# EAGLE design PT4115_LED_Driver (EAGLE 6.0)
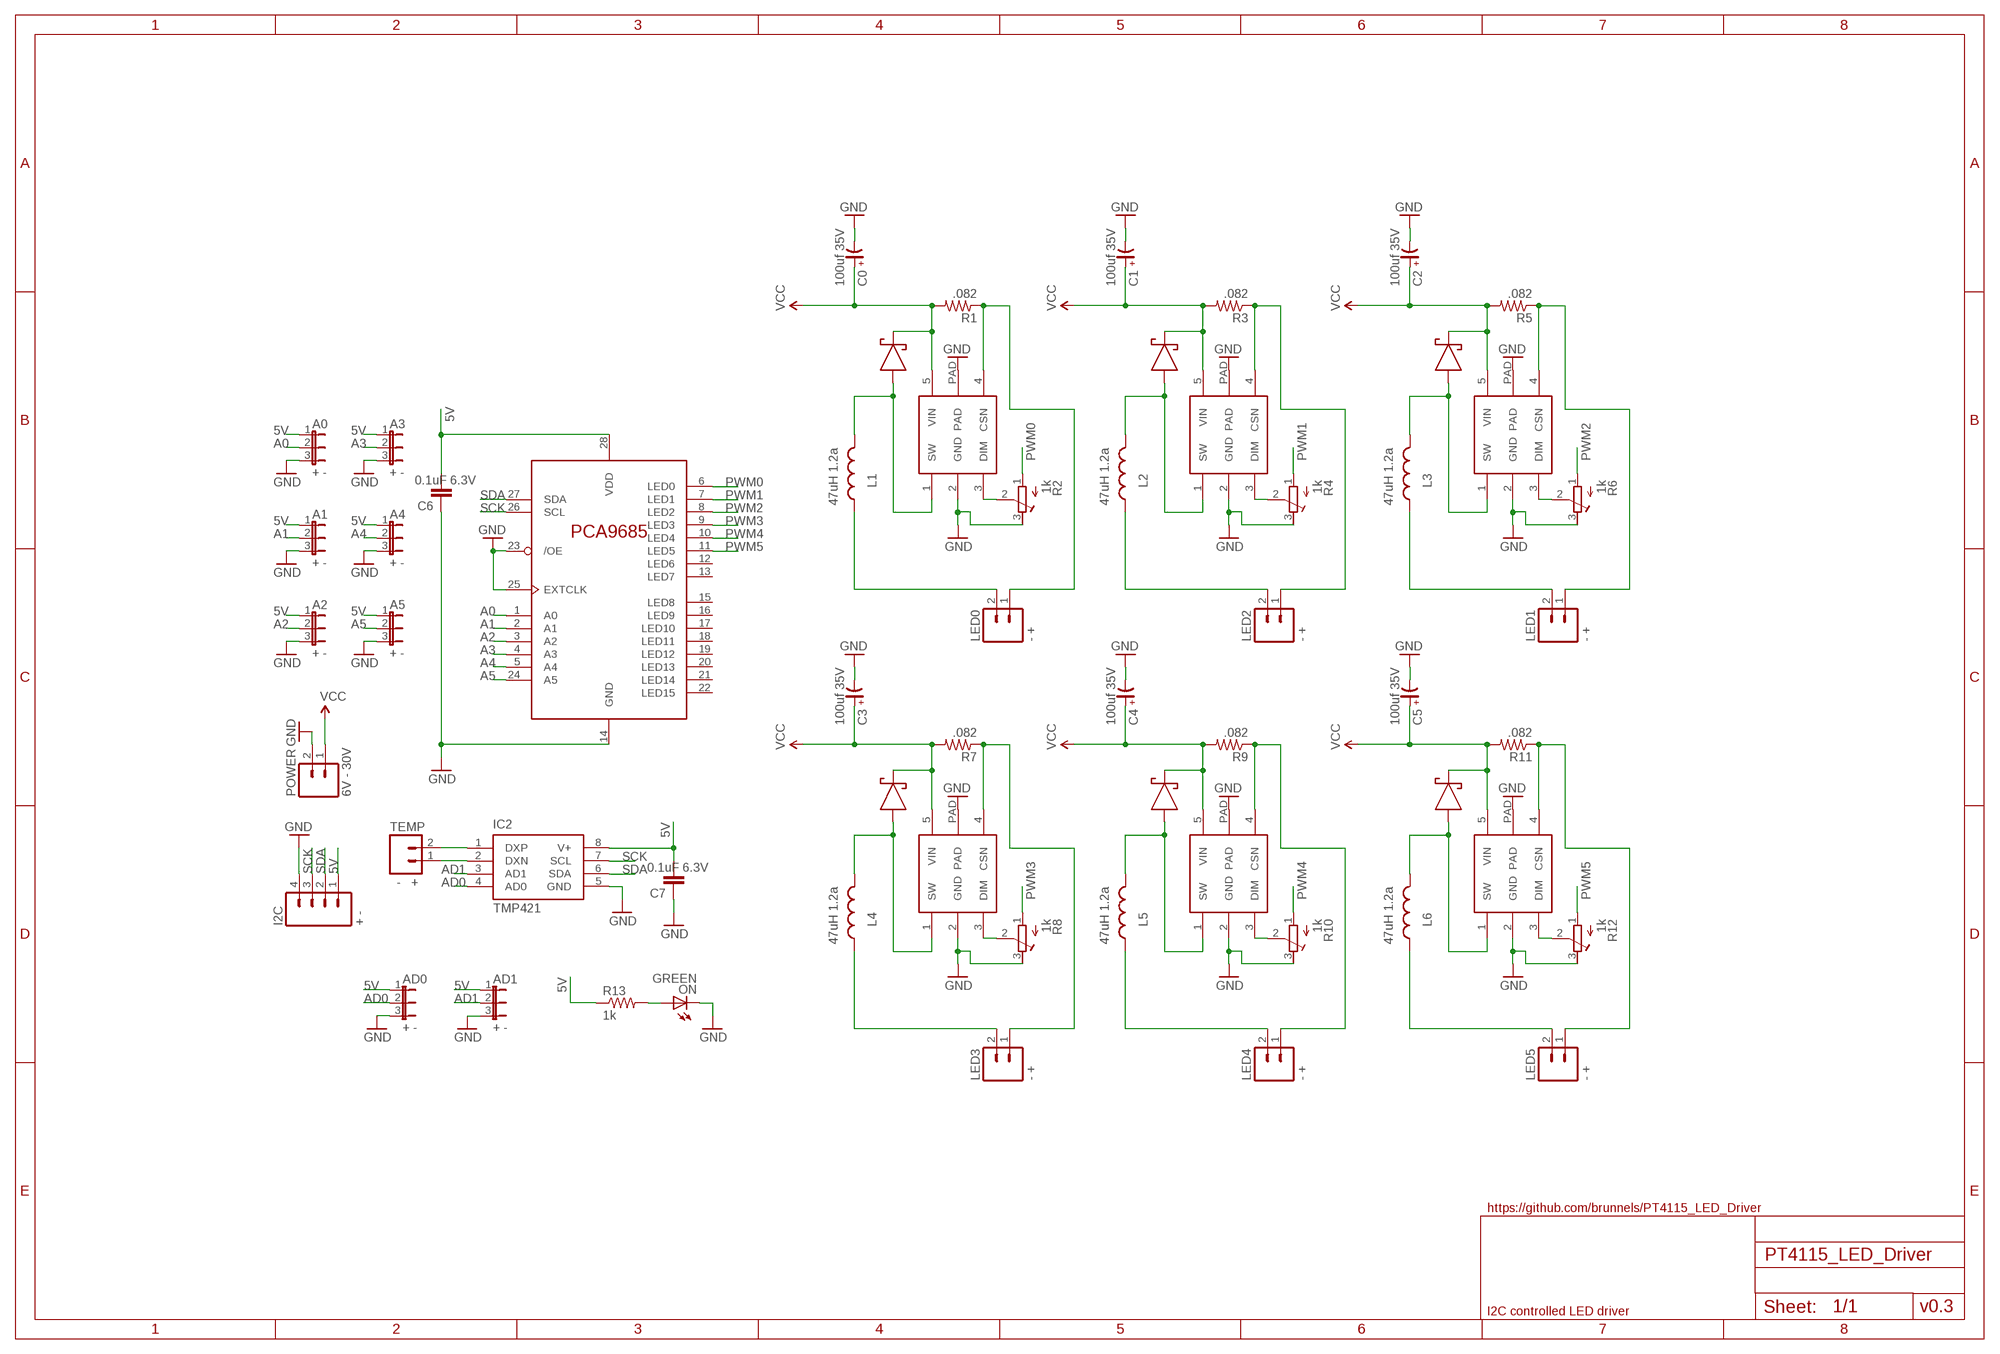
[diagram p0: schematic, sheet 1]

## Parts
A0  + -  JUMPER-3SMD  [SJ_3]
A1  + -  JUMPER-3SMD  [SJ_3]
A2  + -  JUMPER-3SMD  [SJ_3]
A3  + -  JUMPER-3SMD  [SJ_3]
A4  + -  JUMPER-3SMD  [SJ_3]
A5  + -  JUMPER-3SMD  [SJ_3]
AD0  + -  JUMPER-3SMD  [SJ_3]
AD1  + -  JUMPER-3SMD  [SJ_3]
C0  100uf 35V  CP_SV-E/F  [CSV-E/F]
C1  100uf 35V  CP_SV-E/F  [CSV-E/F]
C2  100uf 35V  CP_SV-E/F  [CSV-E/F]
C3  100uf 35V  CP_SV-E/F  [CSV-E/F]
C4  100uf 35V  CP_SV-E/F  [CSV-E/F]
C5  100uf 35V  CP_SV-E/F  [CSV-E/F]
C6  0.1uF 6.3V  CAP0805  [0805]
C7  0.1uF 6.3V  CAP0805  [0805]
D1  SCHOTTKY_DIODE-SS18  [DO-214]
D2  SCHOTTKY_DIODE-SS18  [DO-214]
D3  SCHOTTKY_DIODE-SS18  [DO-214]
D4  SCHOTTKY_DIODE-SS18  [DO-214]
D5  SCHOTTKY_DIODE-SS18  [DO-214]
D6  SCHOTTKY_DIODE-SS18  [DO-214]
DRV0  PT4115  [SOT89-5]
DRV1  PT4115  [SOT89-5]
DRV2  PT4115  [SOT89-5]
DRV3  PT4115  [SOT89-5]
DRV4  PT4115  [SOT89-5]
DRV5  PT4115  [SOT89-5]
I2C  + -  M04POLAR  [MOLEX-1X4]
IC1  PCA9685PW  [TSSOP28]
IC2  TMP421  [SOT23-8]
L1  47uH 1.2a  INDUCTORCR54  [CR54]
L2  47uH 1.2a  INDUCTORCR54  [CR54]
L3  47uH 1.2a  INDUCTORCR54  [CR54]
L4  47uH 1.2a  INDUCTORCR54  [CR54]
L5  47uH 1.2a  INDUCTORCR54  [CR54]
L6  47uH 1.2a  INDUCTORCR54  [CR54]
LED0  - +  M023.5MM  [SCREWTERMINAL-3.5MM-2]
LED1  - +  M023.5MM  [SCREWTERMINAL-3.5MM-2]
LED2  - +  M023.5MM  [SCREWTERMINAL-3.5MM-2]
LED3  - +  M023.5MM  [SCREWTERMINAL-3.5MM-2]
LED4  - +  M023.5MM  [SCREWTERMINAL-3.5MM-2]
LED5  - +  M023.5MM  [SCREWTERMINAL-3.5MM-2]
ON  GREEN  LEDCHIPLED_0805  [CHIPLED_0805]
POWER  6V - 30V  M023.5MM  [SCREWTERMINAL-3.5MM-2]
R1  .082  RESISTOR1206  [1206]
R2  1k  R-TRIMM3296W  [RTRIM3296W]
R3  .082  RESISTOR1206  [1206]
R4  1k  R-TRIMM3296W  [RTRIM3296W]
R5  .082  RESISTOR1206  [1206]
R6  1k  R-TRIMM3296W  [RTRIM3296W]
R7  .082  RESISTOR1206  [1206]
R8  1k  R-TRIMM3296W  [RTRIM3296W]
R9  .082  RESISTOR1206  [1206]
R10  1k  R-TRIMM3296W  [RTRIM3296W]
R11  .082  RESISTOR1206  [1206]
R12  1k  R-TRIMM3296W  [RTRIM3296W]
R13  1k  RESISTOR0603-RES  [0603-RES]
TEMP  - +  M02PTH  [1X02]

## Nets
5V: A0.1 A1.1 A2.1 A3.1 A4.1 A5.1 AD0.1 AD1.1 C6.2 C7.2 I2C.1 IC1.28(VDD) IC2.8(V+) R13.1
A0: A0.2 IC1.1(A0)
A1: A1.2 IC1.2(A1)
A2: A2.2 IC1.3(A2)
A3: A3.2 IC1.4(A3)
A4: A4.2 IC1.5(A4)
A5: A5.2 IC1.24(A5)
AD0: AD0.2 IC2.4(AD0)
AD1: AD1.2 IC2.3(AD1)
GND: A0.3 A1.3 A2.3 A3.3 A4.3 A5.3 AD0.3 AD1.3 C0.- C1.- C2.- C3.- C4.- C5.- C6.1 C7.1 DRV0.2(GND) DRV0.PAD DRV1.2(GND) DRV1.PAD DRV2.2(GND) DRV2.PAD DRV3.2(GND) DRV3.PAD DRV4.2(GND) DRV4.PAD DRV5.2(GND) DRV5.PAD I2C.4 IC1.14(GND) IC1.23(/OE) IC1.25(EXTCLK) IC2.5(GND) ON.C POWER.2 R2.3(A) R4.3(A) R6.3(A) R8.3(A) R10.3(A) R12.3(A)
N$1: DRV1.4(CSN) LED2.1 R3.1
N$2: IC2.1(DXP) TEMP.2
N$3: IC2.2(DXN) TEMP.1
N$4: D1.P$2(ANODE) DRV1.1(SW) L2.P$2
N$5: DRV1.3(DIM) R4.2(S)
N$6: DRV0.4(CSN) LED0.1 R1.1
N$7: D3.P$2(ANODE) DRV0.1(SW) L1.P$2
N$8: DRV0.3(DIM) R2.2(S)
N$10: L1.P$1 LED0.2
N$11: L2.P$1 LED2.2
N$12: DRV2.4(CSN) LED1.1 R5.1
N$13: D2.P$2(ANODE) DRV2.1(SW) L3.P$2
N$14: DRV2.3(DIM) R6.2(S)
N$15: L3.P$1 LED1.2
N$16: DRV3.4(CSN) LED3.1 R7.1
N$17: D4.P$2(ANODE) DRV3.1(SW) L4.P$2
N$18: DRV3.3(DIM) R8.2(S)
N$19: L4.P$1 LED3.2
N$20: DRV4.4(CSN) LED4.1 R9.1
N$21: D5.P$2(ANODE) DRV4.1(SW) L5.P$2
N$22: DRV4.3(DIM) R10.2(S)
N$23: L5.P$1 LED4.2
N$24: DRV5.4(CSN) LED5.1 R11.1
N$25: D6.P$2(ANODE) DRV5.1(SW) L6.P$2
N$26: DRV5.3(DIM) R12.2(S)
N$27: L6.P$1 LED5.2
N$30: ON.A R13.2
PWM0: IC1.6(LED0) R2.1(E)
PWM1: IC1.7(LED1) R4.1(E)
PWM2: IC1.8(LED2) R6.1(E)
PWM3: IC1.9(LED3) R8.1(E)
PWM4: IC1.10(LED4) R10.1(E)
PWM5: IC1.11(LED5) R12.1(E)
SCK: I2C.3 IC1.26(SCL) IC2.7(SCL)
SDA: I2C.2 IC1.27(SDA) IC2.6(SDA)
VCC: C0.+ C1.+ C2.+ C3.+ C4.+ C5.+ D1.P$1(CATHODE) D2.P$1(CATHODE) D3.P$1(CATHODE) D4.P$1(CATHODE) D5.P$1(CATHODE) D6.P$1(CATHODE) DRV0.5(VIN) DRV1.5(VIN) DRV2.5(VIN) DRV3.5(VIN) DRV4.5(VIN) DRV5.5(VIN) POWER.1 R1.2 R3.2 R5.2 R7.2 R9.2 R11.2
Unconnected: IC1.12(LED6) IC1.13(LED7) IC1.15(LED8) IC1.16(LED9) IC1.17(LED10) IC1.18(LED11) IC1.19(LED12) IC1.20(LED13) IC1.21(LED14) IC1.22(LED15)

## Notes on the sheet
- https://github.com/brunnels/PT4115_LED_Driver
- I2C controlled LED driver | v0.3

## Library data of the parts
A0 A1-A5 AD0 AD1 = SparkFun:JUMPER-3
C0 C1-C5 = rc-master:CP_: POLARIZED CAP
C6 C7 = SparkFun:CAP: Capacitor Standard 0603 ceramic capacitor, and 0.1" leaded capacitor.
D1-D6 = 1dah:SCHOTTKY_DIODE: 40V, 1A schottky diode
DRV0 DRV1-DRV5 = 1dah:PT4115: Small switching mode constant current PS
I2C = SparkFun:M04: Header 4 Standard 4-pin 0.1" header. Use with straight break away headers (SKU : PRT-00116), right angle break away headers (PRT-00553), swiss pins (PRT-00743), machine pins (PRT-00117), and female headers (PRT-00115). Molex polarized connector foot print use with SKU : PRT-08231 with associated crimp pins and housings. 1MM SMD Version SKU: PRT-10208
IC1 = i2c-led-controller:PCA9685
IC2 = mylib:TMP421
L1-L6 = SparkFun:INDUCTOR: Inductors Basic Inductor/Choke - 0603 and 1206. Footprints are not proven and vary greatly between part numbers.
LED0 LED1-LED5 POWER TEMP = SparkFun:M02: Header 2 Standard 2-pin 0.1" header. Use with straight break away headers (SKU : PRT-00116), right angle break away headers (PRT-00553), swiss pins (PRT-00743), machine pins (PRT-00117), and female headers (PRT-00115). Molex polarized connector foot print use with SKU : PRT-08233 with associated crimp pins and housings.
ON = led:LED: LED OSRAM: - CHIPLED LG R971, LG N971, LY N971, LG Q971, LY Q971, LO R971, LY R971 LH N974, LH R974 LS Q976, LO Q976, LY Q976 LO Q996 - Hyper CHIPLED LW Q18S LB Q993, LB Q99A, LB R99A - SideLED LS A670, LO A670, LY A670, LG A670, LP A670 LB A673, LV A673, LT A673, LW A673 LH A674 LY A675 LS A676, LA A676, LO A676, LY A676, LW A676 LS A679, LY A679, LG A679 - Hyper Micro SIDELED® LS Y876, LA Y876, LO Y876, LY Y876 LT Y87S - SmartLED LW L88C, LW L88S LB L89C, LB L89S, LG L890 LS L89K, LO L89K, LY L89K LS L896, LA L896, LO L896, LY L896 - TOPLED LS T670, LO T670, LY T670, LG T670, LP T670 LSG T670, LSP T670, LSY T670, LOP T670, LYG T670 LG T671, LOG T671, LSG T671 LB T673, LV T673, LT T673, LW T673 LH T674 LS T676, LA T676, LO T676, LY T676, LB T676, LH T676, LSB T676, LW T676 LB T67C, LV T67C, LT T67C, LS T67K, LO T67K, LY T67K, LW E67C LS E67B, LA E67B, LO E67B, LY E67B, LB E67C, LV E67C, LT E67C LW T67C LS T679, LY T679, LG T679 LS T770, LO T770, LY T770, LG T770, LP T770 LB T773, LV T773, LT T773, LW T773 LH T774 LS E675, LA E675, LY E675, LS T675 LS T776, LA T776, LO T776, LY T776, LB T776 LHGB T686 LT T68C, LB T68C - Hyper Mini TOPLED® LB M676 - Mini TOPLED Santana® LG M470 LS M47K, LO M47K, LY M47K Source: http://www.osram.convergy.de LUXEON: - LUMILED® LXK2-PW12-R00, LXK2-PW12-S00, LXK2-PW14-U00, LXK2-PW14-V00 LXK2-PM12-R00, LXK2-PM12-S00, LXK2-PM14-U00 LXK2-PE12-Q00, LXK2-PE12-R00, LXK2-PE12-S00, LXK2-PE14-T00, LXK2-PE14-U00 LXK2-PB12-K00, LXK2-PB12-L00, LXK2-PB12-M00, LXK2-PB14-N00, LXK2-PB14-P00, LXK2-PB14-Q00 LXK2-PR12-L00, LXK2-PR12-M00, LXK2-PR14-Q00, LXK2-PR14-R00 LXK2-PD12-Q00, LXK2-PD12-R00, LXK2-PD12-S00 LXK2-PH12-R00, LXK2-PH12-S00 LXK2-PL12-P00, LXK2-PL12-Q00, LXK2-PL12-R00 Source: www.luxeon.com KINGBRIGHT: KA-3528ASYC Source: www.kingbright.com
R1 R3 R5 R7 R9 R11 = 1dah:RESISTOR: Resistor
R2 R4 R6 R8 R10 R12 = resistor:R-TRIMM: Trimm resistor
R13 = SparkFun:RESISTOR: Resistor

## Board
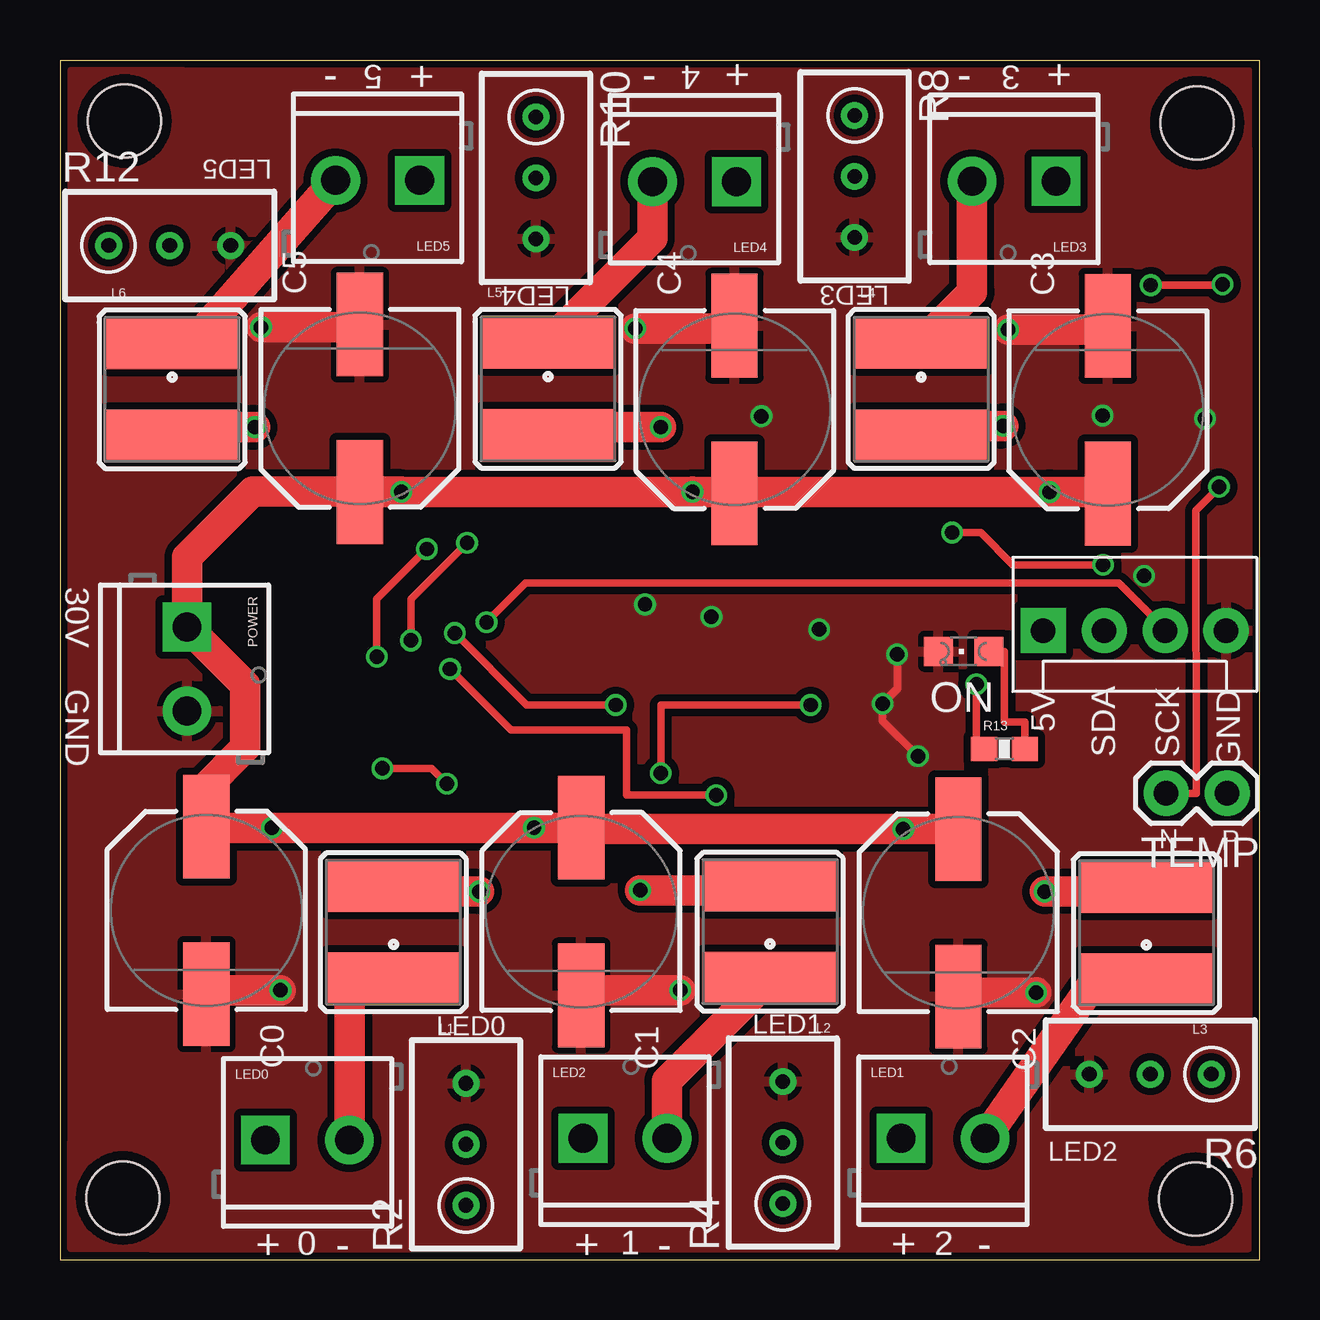
[diagram p1: board, top side]
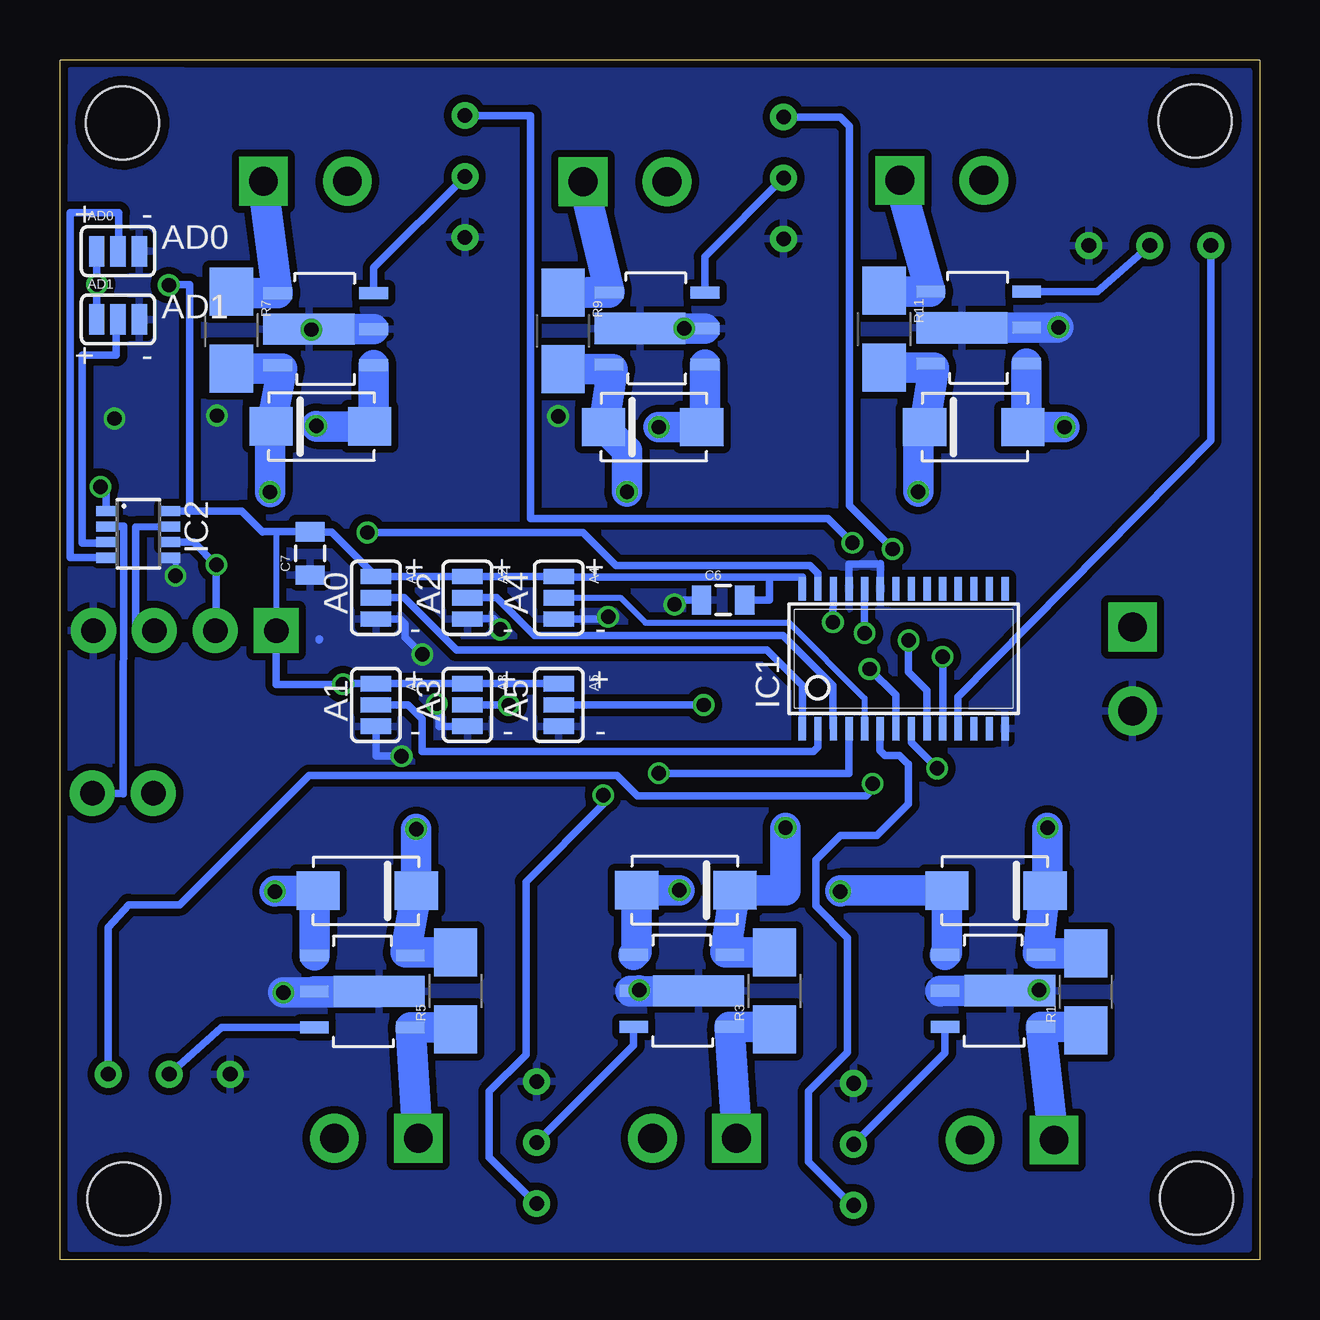
[diagram p2: board, bottom side, seen from below]

Size 50 x 50 mm. Coordinates in mm from the lower left corner, seen from the top.
Outline: 0,0 50,0 50,50 0,50 0,0
Copper layers (1*16): Top 0.035mm / dielectric 1.5mm / Bottom 0.035mm
Design rules: minimum track width 6mil, minimum drill 12mil, track to track 6mil, track to pad 6mil, pad to pad 6mil, via to via 6mil, smd to smd 0mil, copper to edge 10mil, drill to drill 10mil, minimum pad ring 10mil, minimum via ring 6mil, stop-mask expansion 2mil, vias tented up to drill 100mil, thermal gap 10mil

### Footprints (pad centres in the part's own frame; a part is rotated, then mirrored left to right if it is on the bottom)
STAND-OFF-TIGHT = hole 3.048: 0,0
SJ_3 = smd 0.635 x 1.27: 1 -0.889,0; 2 0,0; 3 0.889,0
CSV-E/F = smd 4.318 x 1.93: + -3.493,0; - 3.493,0
0805 = smd 0.8 x 1.2: 1 -0.9,0; 2 0.9,0
DO-214 = smd 1.8 x 1.6: P$1 -2.1,0; P$2 2,0
SOT89-5 = smd 0.5 x 1.2: 1 -1.5,-2; 2 0,-2; 3 1.5,-2; 4 1.5,2; 5 -1.5,2 | smd 1.3 x 3.8: PAD 0,0.7
MOLEX-1X4 = drill 1.016 pad 1.88 square: 1 0,0 | drill 1.016 pad 1.88: 2 2.54,0; 3 5.08,0; 4 7.62,0
TSSOP28 = smd 0.305 x 0.991: 1 -4.225,-2.918; 2 -3.575,-2.918; 3 -2.925,-2.918; 4 -2.275,-2.918; 5 -1.625,-2.918; 6 -0.975,-2.918; 7 -0.325,-2.918; 8 0.325,-2.918; 9 0.975,-2.918; 10 1.625,-2.918; 11 2.275,-2.918; 12 2.925,-2.918; 13 3.575,-2.918; 14 4.225,-2.918; 15 4.225,2.918; 16 3.575,2.918; 17 2.925,2.918; 18 2.275,2.918; 19 1.625,2.918; 20 0.975,2.918; 21 0.325,2.918; 22 -0.325,2.918; 23 -0.975,2.918; 24 -1.625,2.918; 25 -2.275,2.918; 26 -2.925,2.918; 27 -3.575,2.918; 28 -4.225,2.918
SOT23-8 = smd 0.42 x 0.8: 1 -0.95,-1.55; 2 -0.3,-1.55; 3 0.35,-1.55; 4 1,-1.55; 5 1,1.15; 6 0.35,1.15; 7 -0.3,1.15; 8 -0.95,1.15
CR54 = smd 5.5 x 2.15: P$1 0,1.92; P$2 0,-1.92
SCREWTERMINAL-3.5MM-2 = drill 1.2 pad 2.032 square: 1 0,0 | drill 1.2 pad 2.032: 2 3.5,0
CHIPLED_0805 = smd 1.2 x 1.2: A 0,-1.05; C 0,1.05
1206 = smd 2 x 1.8: 1 -1.6,0; 2 1.6,0
RTRIM3296W = drill 0.61: 1 0,-2.54; 2 0,0; 3 0,2.54
0603-RES = smd 1.1 x 1: 1 -0.85,0; 2 0.85,0
1X02 = drill 1.016 pad 1.88: 1 0,0; 2 2.54,0

### Placement (x,y rotation side)
5V  [STAND-OFF-TIGHT]  2.69,47.46 0 top
5V1  [STAND-OFF-TIGHT]  47.4,47.38 0 top
A0  36.83,27.58 270 bottom
A1  36.83,23.11 270 bottom
A2  33.02,27.58 270 bottom
A3  33.02,23.11 270 bottom
A4  29.21,27.58 270 bottom
A5  29.21,23.11 270 bottom
AD0  47.58,42.03 0 bottom
AD1  47.58,39.19 0 bottom
C0  6.1,14.55 270 top
C1  21.72,14.5 270 top
C2  37.45,14.45 270 top
C3  43.68,35.42 90 top
C4  28.12,35.43 90 top
C5  12.5,35.48 90 top
C6  22.36,27.49 0 bottom
C7  39.57,29.44 90 bottom
D1  23.96,15.39 180 bottom
D2  37.24,15.37 180 bottom
D3  11.04,15.38 180 bottom
D4  39.1,34.72 0 bottom
D5  25.25,34.7 0 bottom
D6  11.86,34.7 0 bottom
DRV0  11.11,11.2 270 bottom
DRV1  24.09,11.2 270 bottom
DRV2  37.4,11.18 270 bottom
DRV3  38.92,38.79 90 bottom
DRV4  25.12,38.81 90 bottom
DRV5  11.71,38.84 90 bottom
I2C  40.99,26.21 0 top
IC1  14.83,25.04 0 bottom
IC2  46.53,30.25 270 bottom
L1  13.9,13.64 180 top
L2  29.6,13.67 180 top
L3  45.29,13.61 180 top
L4  35.9,36.28 0 top
L5  20.35,36.3 0 top
L6  4.67,36.27 0 top
LED0  8.57,4.98 0 top
LED1  35.06,5.05 0 top
LED2  21.8,5.05 0 top
LED3  41.52,44.95 180 top
LED4  28.19,44.93 180 top
LED5  14.99,44.98 180 top
ON  37.67,25.35 90 top
POWER  5.3,26.37 270 top
R1  7.25,11.15 90 bottom
R2  16.92,4.8 0 top
R3  20.23,11.2 90 bottom
R4  30.13,4.88 0 top
R5  33.51,11.2 90 bottom
R6  45.45,7.72 90 top
R7  42.85,38.73 270 bottom
R8  33.12,45.15 180 top
R9  29.03,38.71 270 bottom
R10  19.84,45.09 180 top
R11  15.65,38.79 270 bottom
R12  4.57,42.27 270 top
R13  39.37,21.29 0 top
TEMP  48.65,19.44 180 top
U$3  [STAND-OFF-TIGHT]  47.33,2.52 0 top
U$4  [STAND-OFF-TIGHT]  2.62,2.57 0 top

### Tracks (layer width: path | path; a pad name or v marks a point on that pad's centre or on a via)
5V  (via drill 0.6)
  Top 0.254: 38.2,21.7 R13.1
  Top 0.305: v38.2,23.98 38.2,21.7 | v45.47,40.62 48.46,40.62 v48.46,40.64
  Bottom 0.254: A4.1 29.23,28.47 29.23,28.45 | 40.44,30.35 41,30.35 40.99,30.35 I2C.1
  Bottom 0.305: AD0.1 AD1.1 v48.46,40.64 | A4.1 A2.1 A0.1 38.68,30.33 39.57,30.33 | A5.1 A3.1 A1.1 38.1,24 v38.2,23.98 40.99,23.98 I2C.1 40.44,26.21 | C7.2 40.44,30.35 | IC1.28 19.06,28.45 20.42,28.45 | 29.26,28.45 29.23,28.45 20.42,28.45 | IC2.8 44.6,31.2 | 44.6,31.2 42.43,31.2 41.55,30.33 41.55,30.34 C7.2 | C7.2 39.57,30.33 | 39.57,30.33 39.6,30.33 | C6.2 20.42,27.49 20.42,28.45 | 44.6,31.2 44.6,40.64 45.47,40.64 v45.47,40.62
A0
  Bottom 0.305: A0.2 35.66,27.58 33.48,25.4 20.52,25.4 19.05,23.93 IC1.1
  Bottom 0.406: 36.85,27.6 A0.2
A1
  Bottom 0.305: IC1.2 18.41,21.37 18.59,21.18 34.9,21.18 34.9,22.53 35.48,23.11 A1.2
A2
  Bottom 0.305: A2.2 31.8,27.58 30.23,26.01 19.86,26.01 17.78,23.93 17.78,22.15 IC1.3
A3  (via drill 0.6)
  Top 0.305: v25.04,20.27 25.04,23.11 v31.29,23.11
  Bottom 0.305: IC1.4 17.12,20.27 v25.04,20.27 | v31.29,23.11 A3.2
A4
  Bottom 0.254: A4.2 26.64,27.58 25.6,26.54 19.61,26.54 16.46,23.39 IC1.5
  Bottom 0.305: IC1.5
A5  (via drill 0.6)
  Top 0.305: v23.16,23.11 19.46,23.11 v16.46,26.11
  Bottom 0.305: A5.2 v23.16,23.11 | v16.46,26.11 IC1.24 | IC1.24
AD0
  Bottom 0.305: AD0.2 47.55,42.03 47.55,43.64 49.58,43.64 49.58,29.26 48.69,29.26 IC2.4
AD1
  Bottom 0.305: AD1.2 47.65,39.19 47.65,37.69 49.07,37.69 49.07,29.87 47.88,29.87 IC2.3
GND  (via drill 0.6)
  Top 0.254: v45.19,28.5 45.21,28.52 45.41,28.52
  Top 0.305: v34.29,23.16 34.9,23.77 | 34.9,23.77 v34.9,25.22 | 34.9,23.77 34.87,23.77 34.29,23.19 34.29,22.45 v35.76,20.98
  Top 1.27: v8.38,38.86 12.5,38.86 C5.- | v23.98,38.81 27.96,38.81 C4.- | C3.- 43.69,38.76 v39.52,38.76 | v40.69,11.12 37.58,11.11 C2.- | C1.- 21.94,11.23 v25.86,11.23 | v9.2,11.23 5.93,11.21 C0.-
  Bottom 0.152: 36.1,11.15 DRV2.PAD
  Bottom 0.254: IC2.5 45.19,29.05 v45.19,28.5
  Bottom 0.305: IC1.25 17.11,28.97 17.12,28.98 15.82,28.98 15.8,29.01 15.8,27.97 IC1.23 | A4.3 27.25,26.7 v27.15,26.8 | v31.65,26.26 31.67,26.29 31.67,26.47 31.93,26.72 32.99,26.72 A2.3 | A0.3 35.81,26.7 35.61,26.49 35.61,25.93 v34.9,25.22 | A3.3 34.19,22.23 34.19,23.06 v34.29,23.16 | v35.76,20.98 36.83,20.98 A1.3 | 39.17,25.86 39.19,25.86 39.19,25.83 | C6.1 24.32,27.49 v24.38,27.3
  Bottom 1.27: DRV3.PAD DRV3.2 | DRV5.2 DRV5.PAD 8.43,38.84 v8.38,38.86 | DRV4.2 DRV4.PAD v23.98,38.81 | 13.31,11.18 13.31,11.2 DRV0.PAD 10.38,11.23 v9.2,11.23 | DRV2.2 DRV2.PAD 36.75,11.12 v40.69,11.12 | DRV1.2 26.21,11.2 26.21,11.18 25.81,11.18 | DRV1.PAD 23.39,11.18 25.81,11.18 | v25.86,11.23 25.81,11.18
  other vias: 43.46,35.18 29.24,35.15 47.73,35.05
  pour Bottom (isolate 0.305): 0.2,49.78 49.58,49.78 49.58,0.2 0.2,0.2
  pour Top (isolate 0.305): 0.2,49.78 49.58,49.78 49.58,0.41 0.2,0.41
  pour Bottom (isolate 0.203): 49.56,31.47 49.56,20.78 38.96,20.88
N$1
  Bottom 1.27: 20.55,9.58 20.53,9.6 R3.1 20.23,9.7 DRV1.4 21.78,5.16 LED2.1
N$2  (via drill 0.6)
  Top 0.305: v48.31,32.21 48.31,32.18 47.35,31.22 47.37,19.44 TEMP.2
  Bottom 0.305: IC2.1 48.08,31.98 v48.31,32.21
N$3
  Bottom 0.305: 47.45,30.58 47.45,30.55 IC2.2 47.88,30.58 47.35,30.58 47.37,19.41 47.38,19.44 TEMP.1
N$4  (via drill 0.6)
  Top 1.27: L2.P$2 29.41,15.39 v24.18,15.39
  Bottom 1.27: v24.18,15.39 D1.P$2 25.96,12.83 DRV1.1
N$5
  Bottom 0.305: DRV1.3 26.09,8.92 R4.2
N$6
  Bottom 1.27: LED0.1 8.6,5.08 DRV0.4 7.25,9.7 R1.1
N$7  (via drill 0.6)
  Top 1.27: v17.48,15.34 13.9,15.34 L1.P$2
  Bottom 1.27: DRV0.1 13.04,12.77 D3.P$2 17.48,15.38 v17.48,15.34
N$8
  Bottom 0.305: DRV0.3 13.11,8.62 R2.2
N$10
  Top 1.27: L1.P$1 12.07,11.72 LED0.2
N$11
  Top 1.27: L2.P$1 25.3,7.45 LED2.2
N$12
  Bottom 1.27: LED1.1 35.09,5.05 DRV2.4 33.51,9.68 R5.1
N$13  (via drill 0.6)
  Top 1.27: L3.P$2 45.1,15.34 v41.05,15.34
  Bottom 1.27: DRV2.1 39.4,15.11 D2.P$2 41.02,15.37 v41.05,15.34
N$14
  Bottom 0.305: DRV2.3 43.26,9.68 R6.2
N$15
  Top 1.27: L3.P$1 43.22,11.71 LED1.2
N$16
  Bottom 1.27: LED3.1 41.55,44.95 40.95,40.34 40.92,40.34 DRV3.4 42.85,40.29 R7.1
N$17  (via drill 0.6)
  Top 1.27: L4.P$2 36.28,34.75 v39.32,34.75
  Bottom 1.27: DRV3.1 36.92,34.89 D4.P$2 39.29,34.72 v39.32,34.75
N$18
  Bottom 0.305: R8.2 36.92,41.34 DRV3.3
N$19
  Top 1.27: L4.P$1 38.02,40.33 LED3.2
N$20
  Bottom 1.27: LED4.1 27.1,40.34 R9.1 DRV4.4
N$21  (via drill 0.6)
  Top 1.27: L5.P$2 20.66,34.7 v25.04,34.7
  Bottom 1.27: DRV4.1 23.12,34.82 D5.P$2 v25.04,34.7
N$22
  Bottom 0.305: R10.2 23.12,41.8 DRV4.3
N$23
  Top 1.27: L5.P$1 24.69,42.56 LED4.2
N$24
  Bottom 1.27: LED5.1 15.03,44.98 DRV5.4 15.65,40.34 R11.1
N$25  (via drill 0.6)
  Top 1.27: L6.P$2 5.02,34.7 v8.13,34.7
  Bottom 1.27: DRV5.1 9.71,34.85 D6.P$2 v8.13,34.7
N$26
  Bottom 0.305: DRV5.3 6.75,40.34 R12.2
N$27
  Top 1.27: L6.P$1 5.51,38.19 LED5.2
N$30
  Top 0.305: ON.A 39.37,25.35 39.37,22.4 40.22,22.4 R13.2
N$37
  pour Bottom: 5.31,49.56 0.43,49.56 0.43,45.03 5.31,45.03
N$38
  pour Bottom: 44.86,49.58 49.56,49.58 49.56,44.81 44.86,44.81
N$39
  pour Top: 45.8,49.58 49.56,49.58 49.56,44.83 45.01,44.83 45.01,49.58
N$40
  pour Top: 45.54,0.43 49.56,0.43 49.56,4.98 44.93,4.98 44.93,0.43 45.52,0.43
N$41
  pour Top: 4.42,0.43 0.43,0.43 0.43,4.93 5,4.93 5,0.43
N$42
  pour Top: 4.62,49.58 0.43,49.58 0.43,45.06 5.16,45.06 5.16,49.58
N$43
  pour Bottom: 45.59,0.43 49.56,0.43 49.56,4.95 44.81,4.95 44.81,0.43 45.57,0.43
N$44
  pour Bottom: 5,0.43 0.43,0.43 0.43,5.08 5,5.08
PWM0
  Bottom 0.254: R2.1 16.94,2.26 16.97,2.23
  Bottom 0.305: IC1.6 15.82,22.11 15.82,21.21 15.62,21.01 15.01,21.01 14.66,20.65 14.63,20.65 14.63,19 15.95,17.68 17.48,17.68 18.49,16.66 18.49,14.73 17.17,13.41 17.17,8.64 18.8,7.01 18.8,4.06 16.97,2.23
PWM1  (via drill 0.6)
  Top 0.254: 23.62,22.05 23.62,22.07
  Top 0.305: 23.62,22.07 18.8,22.07 v16.26,24.61 | v27.36,19.36 23.62,19.36 23.62,22.05
  Bottom 0.254: 30.18,2.34 R4.1
  Bottom 0.305: v16.26,24.61 15.16,23.54 IC1.7 | v27.36,19.36 27.36,18.97 30.58,15.75 30.58,8.53 32.11,7.01 32.11,4.27 30.18,2.34
PWM2  (via drill 0.6)
  Top 0.305: v16.13,19.84 15.49,20.47 v13.44,20.47
  Bottom 0.305: R6.1 47.99,13.84 47.14,14.78 45.01,14.78 39.62,20.17 26.77,20.17 25.93,19.33 16.41,19.33 16.13,19.61 v16.13,19.84 | 14.5,22.08 IC1.8 14.51,21.54 v13.44,20.47
PWM3  (via drill 0.6)
  Top 0.305: v16.97,29.87 14.63,27.53 v14.63,25.81
  Bottom 0.305: R8.1 30.38,47.69 30.38,30.89 17.98,30.89 v16.97,29.87 | v14.63,25.81 14.63,24.49 13.87,23.72 13.87,22.22 IC1.9
PWM4  (via drill 0.6)
  Top 0.305: v15.29,29.62 13.21,27.53 v13.21,25.12
  Bottom 0.305: IC1.10 13.21,22.15 v13.21,25.12 | R10.1 17.48,47.62 17.09,47.24 17.09,31.42 v15.29,29.62
PWM5
  Bottom 0.305: IC1.11 12.57,22.14 12.57,23.44 2.03,34.14 R12.1
SCK  (via drill 0.6)
  Top 0.254: 46.08,26.26 I2C.3
  Top 0.305: v17.78,26.57 19.41,28.19 44.15,28.19 46.08,26.26
  Bottom 0.305: v17.78,26.57 17.75,27.84 IC1.26 | IC2.7 46.84,30.53 46.84,26.21 I2C.3
SDA  (via drill 0.6)
  Top 0.305: v37.19,30.3 38.38,30.3 39.73,28.96 v43.48,28.96
  Bottom 0.305: IC2.6 44.43,29.9 v43.48,28.96 43.48,26.25 I2C.2 | v37.19,30.3 28.19,30.3 26.82,28.93 18.75,28.93 18.41,28.6 IC1.27
VCC  (via drill 0.6)
  Top 1.27: C5.+ 12.48,32 8.03,32 5.29,29.27 POWER.1 7.72,23.94 7.72,21.34 5.9,19.51 C0.+ 6.15,18 8.69,18 v8.84,18 v19.76,18 C1.+ 21.77,17.95 v35.15,17.95 C2.+ | C5.+ 26.43,31.99 | 26.43,31.99 28.07,31.99 | 28.07,31.99 C4.+ | 28.07,31.99 v41.25,31.99 43.62,31.99 C3.+ | v26.36,32 26.43,31.99 | v14.22,32 12.5,32 C5.+
  Bottom 0.254: 35.6,12.8 35.52,12.8 DRV2.5 | DRV0.5 9.14,12.7 9.14,12.75 | 22.27,12.8 22.15,12.8 22.05,12.8 22.05,12.7 | DRV1.5 22.05,12.7 | 22.05,12.7
  Bottom 0.406: 40.74,37.13 40.77,37.13 DRV3.5 | DRV5.5 13.71,37.28 13.61,37.19 | 26.97,37.11 26.97,37.16 DRV4.5
  Bottom 1.27: R5.2 35.6,12.8 D2.P$1 35.15,15.37 v35.15,17.95 | R7.2 40.74,37.13 D4.P$1 41.25,34.67 v41.25,31.99 | R9.2 26.97,37.11 D5.P$1 | R11.2 13.61,37.19 13.58,37.19 D6.P$1 14.22,34.43 v14.22,32 | R1.2 9.14,12.75 9.25,12.75 8.94,15.34 D3.P$1 8.84,15.38 v8.84,18 | R3.2 22.27,12.8 D1.P$1 19.76,15.39 v19.76,18 | D5.P$1 27.45,34.8 | D5.P$1 26.36,33.71 v26.36,32

### Text on the board
_tsilk: 5 | 4 | 3 | - | + | - | + | - | + | LED5 | LED4 | LED3 | 30V | GND | 5V | GND | SDA | SCK | N | P | LED0 | LED1 | LED2 | + | 0 | - | + | 1 | - | + | 2 | -
_bsilk: AD0 | - | + | AD1 | - | + | + | + | A4 | + | A2 | A0 | - | - | - | + | + | + | A5 | A3 | A1 | - | - | -